# EAGLE schematic esp32 (EAGLE 8.2.2)
CNAME: Simulacare; CREVISION: 1.0.0; DESIGNER: Rinaldo; UNTITLED: Board ESP32
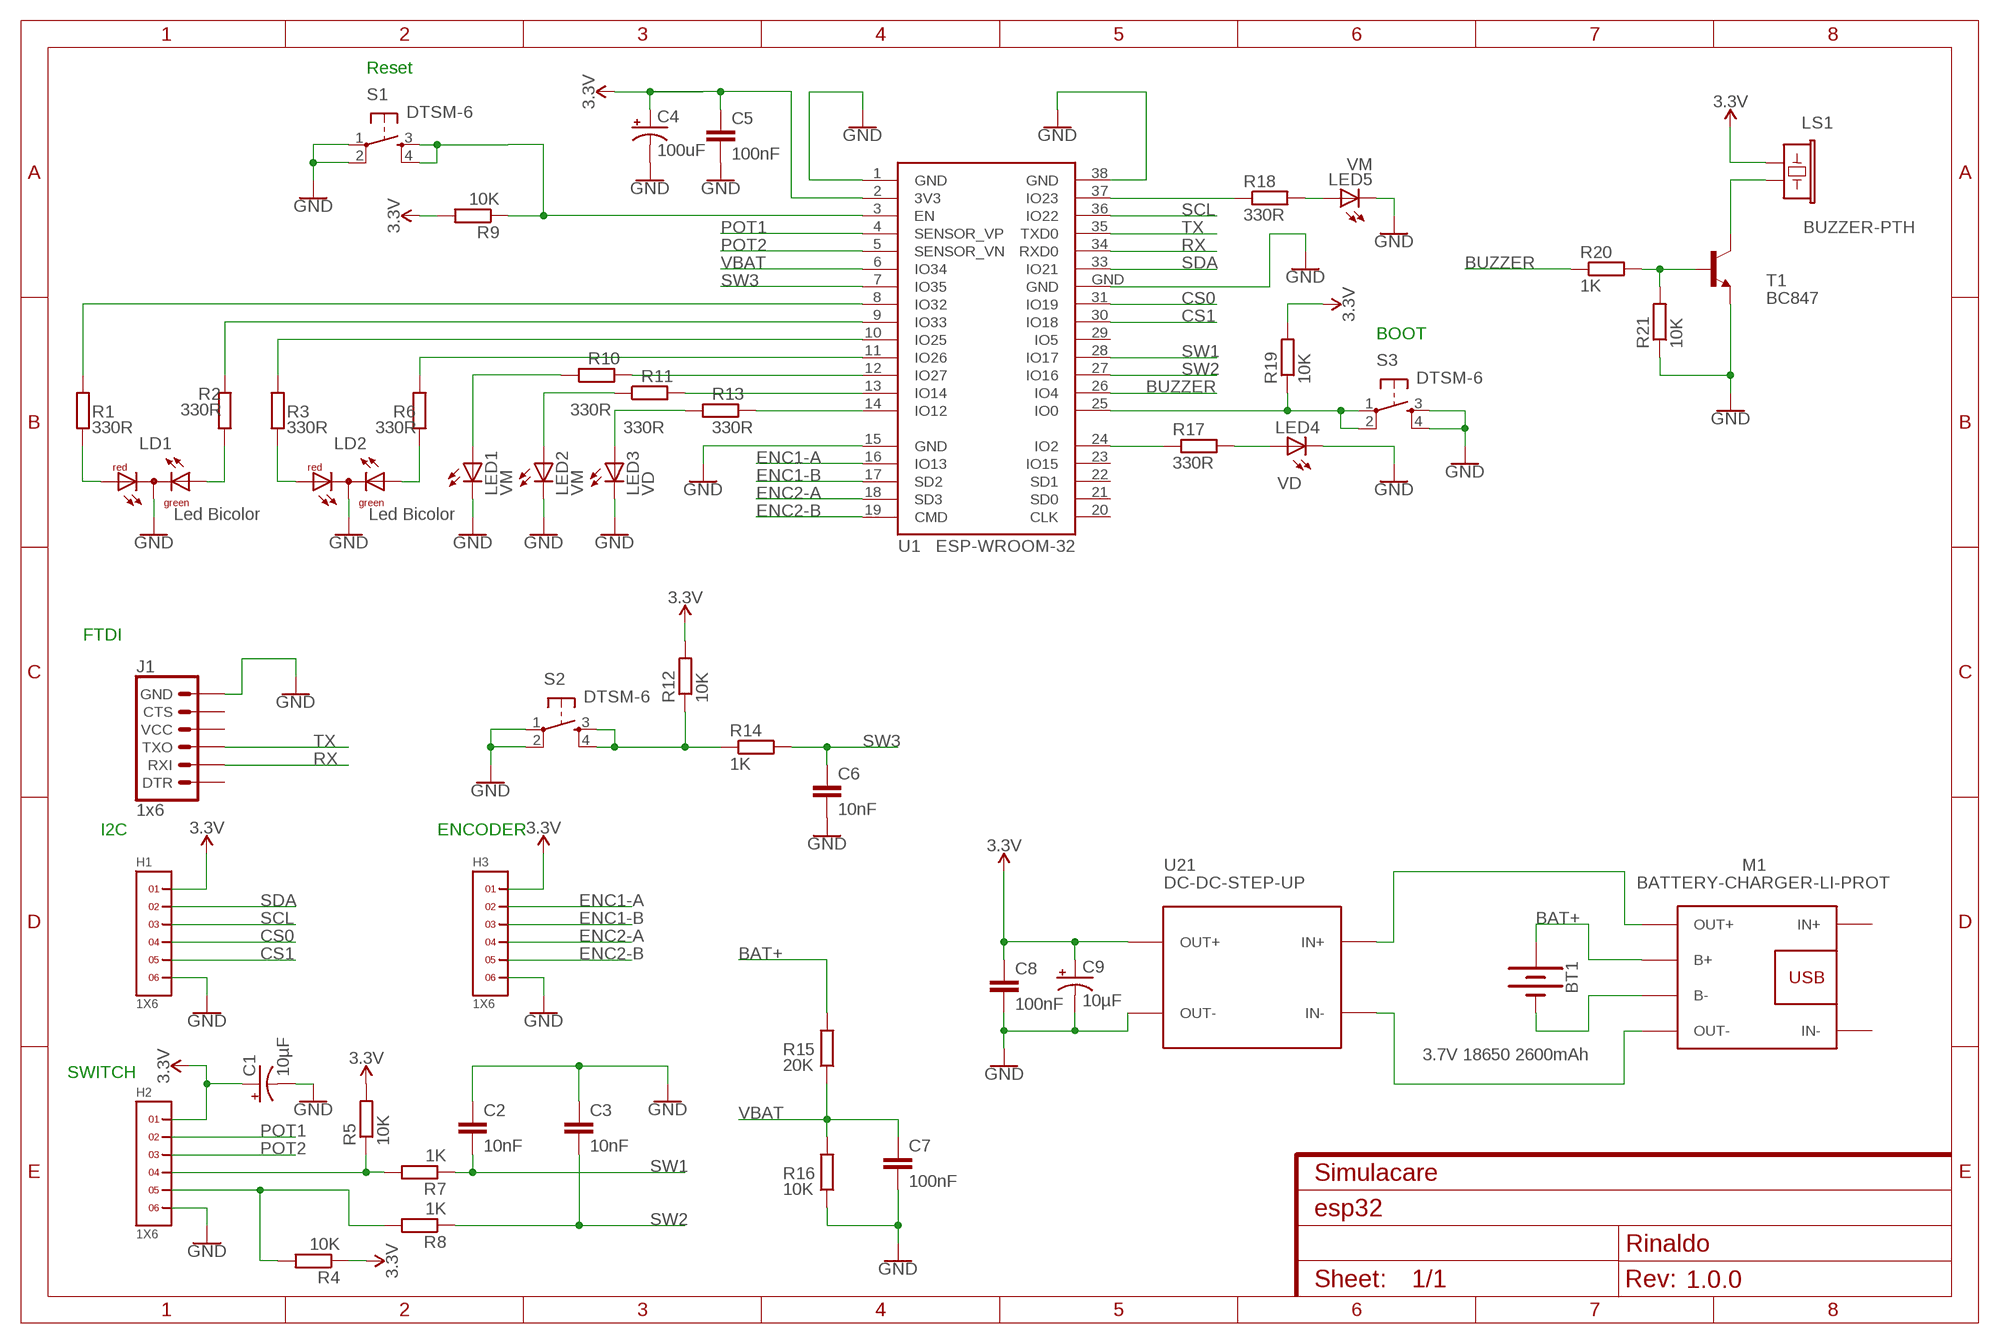
[diagram p0: schematic, sheet 1]

## Parts
BT1  3.7V 18650 2600mAh  BATTERY-18650  [BATTERY_18650-HOLDER]
C1  10µF  10UF-POLAR-EIA6032-25V-10%  [EIA6032-NOM]
C2  10nF  0.1UF-0603-25V-5%  [0603]
C3  10nF  0.1UF-0603-25V-5%  [0603]
C4  100uF  100UF-POLAR-10X10.5-63V-20%  [NIC_10X10.5_CAP]
C5  100nF  0.1UF-0603-25V-5%  [0603]
C6  10nF  0.1UF-0603-25V-5%  [0603]
C7  100nF  0.1UF-0603-25V-5%  [0603]
C8  100nF  0.1UF-0603-25V-5%  [0603]
C9  10µF  10UF-POLAR-EIA6032-25V-10%  [EIA6032-NOM]
H1  1X6  [1X6]
H2  1X6  [1X6]
H3  1X6  [1X6]
J1  1x6  6_PIN_SERIAL_TARGETSILK  [6_PIN_SERIAL_TARGET_SIDE_W_SILK]
LD1  Led Bicolor  DUOLED-RG-C  [DUOLED-C-5MM]
LD2  Led Bicolor  DUOLED-RG-C  [DUOLED-C-5MM]
LED1  VM  LED5MM  [LED5MM]
LED2  VM  LED5MM  [LED5MM]
LED3  VD  LED5MM  [LED5MM]
LED4  VD  LED5MM  [LED5MM]
LED5  VM  LED5MM  [LED5MM]
LS1  BUZZER-PTH  [BUZZER-12MM]
M1  BATTERY-CHARGER-LI-PROT  [BATTERY-CHARGER-LI-PROT]
R1  330R  R-EU_R0603  [R0603]
R2  330R  R-EU_R0603  [R0603]
R3  330R  R-EU_R0603  [R0603]
R4  10K  R-EU_R0603  [R0603]
R5  10K  R-EU_R0603  [R0603]
R6  330R  R-EU_R0603  [R0603]
R7  1K  R-EU_R0603  [R0603]
R8  1K  R-EU_R0603  [R0603]
R9  10K  R-EU_R0603  [R0603]
R10  330R  R-EU_R0603  [R0603]
R11  330R  R-EU_R0603  [R0603]
R12  10K  R-EU_R0603  [R0603]
R13  330R  R-EU_R0603  [R0603]
R14  1K  R-EU_R0603  [R0603]
R15  20K  R-EU_R0603  [R0603]
R16  10K  R-EU_R0603  [R0603]
R17  330R  R-EU_R0603  [R0603]
R18  330R  R-EU_R0603  [R0603]
R19  10K  R-EU_R0603  [R0603]
R20  1K  R-EU_R0603  [R0603]
R21  10K  R-EU_R0603  [R0603]
S1  DTSM-6  [DTSM-6]
S2  DTSM-6  [DTSM-6]
S3  DTSM-6  [DTSM-6]
T1  BC847  [SOT23]
U1  ESP-WROOM-32  [ESP-WROOM-32]
U21  DC-DC-STEP-UP  DC-DC-STEP-UP-MT3608  [DC-DC-STEP-UP-MT3608]

## Nets
3.3V: C1.A(+) C4.+ C5.1 C8.1 C9.A(+) H1.1 H2.1 H3.1 LS1.+ R4.1 R5.2 R9.2 R12.2 R19.2 U1.2(3V3) U21.OUT+
BAT+: BT1.PWR@1(+) M1.B+ R15.2
BUZZER: R20.1 U1.26(IO4)
CS0: H1.4 U1.31(IO19)
CS1: H1.5 U1.30(IO18)
ENC1-A: H3.2 U1.16(IO13)
ENC1-B: H3.3 U1.17(SD2)
ENC2-A: H3.4 U1.18(SD3)
ENC2-B: H3.5 U1.19(CMD)
GND: C1.C(-) C2.1 C3.1 C4.- C5.2 C6.2 C7.2 C8.2 C9.C(-) H1.6 H2.6 H3.6 J1.P$6(GND) LD1.C LD2.C LED1.K(C) LED2.K(C) LED3.K(C) LED4.K(C) LED5.K(C) R16.1 R21.1 S1.1 S1.2 S2.1 S2.2 S3.3 S3.4 T1.2(E) U1.1(GND) U1.15(GND) U1.38(GND) U1.GND U21.OUT-
N$1: R9.1 S1.3 S1.4 U1.3(EN)
N$2: R13.2 U1.14(IO12)
N$3: R11.2 U1.13(IO14)
N$4: R10.2 U1.12(IO27)
N$5: LED3.A R13.1
N$6: LED2.A R11.1
N$7: LED1.A R10.1
N$8: LD1.AR R1.1
N$9: LD1.AX(AG) R2.1
N$10: R1.2 U1.8(IO32)
N$11: R2.2 U1.9(IO33)
N$12: LD2.AR R3.1
N$13: LD2.AX(AG) R6.1
N$14: R3.2 U1.10(IO25)
N$15: R6.2 U1.11(IO26)
N$16: R18.1 U1.37(IO23)
N$17: LED5.A R18.2
N$18: R19.1 S3.1 S3.2 U1.25(IO0)
N$19: R17.1 U1.24(IO2)
N$20: BT1.GND@1(-) M1.B-
N$21: LS1.- T1.3(C)
N$22: R20.2 R21.2 T1.1(B)
N$23: LED4.A R17.2
N$24: R12.1 R14.1 S2.3 S2.4
N$25: H2.4 R5.1 R7.2
N$26: H2.5 R4.2 R8.2
N$29: M1.OUT- U21.IN-
N$30: M1.OUT+ U21.IN+
POT1: H2.2 U1.4(SENSOR_VP)
POT2: H2.3 U1.5(SENSOR_VN)
RX: J1.P$3(RXI) U1.34(RXD0)
SCL: H1.3 U1.36(IO22)
SDA: H1.2 U1.33(IO21)
SW1: C2.2 R7.1 U1.28(IO17)
SW2: C3.2 R8.1 U1.27(IO16)
SW3: C6.1 R14.2 U1.7(IO35)
TX: J1.P$2(TXO) U1.35(TXD0)
VBAT: C7.1 R15.1 R16.2 U1.6(IO34)
Unconnected: J1.P$1(DTR) J1.P$4(VCC) J1.P$5(CTS) M1.IN+ M1.IN- U1.20(CLK) U1.21(SD0) U1.22(SD1) U1.23(IO15) U1.29(IO5)

## Notes on the sheet
- Reset
- BOOT
- FTDI
- I2C | ENCODER
- SWITCH

## Library data of the parts
BT1 = SparkFun-Batteries:BATTERY: Battery - Single Cell A variety of battery chemistries, sizes, and footprints. Device List: 20MM_PTH - Coin Cell Battery Holder - 20mm (PTH) <https://www.sparkfun.com/products/783> 6.8MM_PTH - Coin Cell Battery Holder - 6.8MM(SMD) <https://www.digikey.com/product-detail/en/seiko-instruments/MS621FE-FL11E/728-1057-ND/1889208?WT.srch=1&gclid=CNOQ5a6LzdQCFZS2wAodXCkE0g> 12MM_SMD - Coin Cell Battery Holder - 12mm (SMD) <https://www.sparkfun.com/products/10592> 12MM_PTH - Coin Cell Battery Holder - 12mm (PTH) <https://www.sparkfun.com/products/7948> 20MM_SMD - 20mm Coin Cell Battery Holder (SMD) (2 legs) Used on the Big Time Watch Kit <https://www.sparkfun.com/products/11734> 20MM_SMD_4LEGS - Coin Cell Battery Holder - 20mm (SMD) <https://www.sparkfun.com/products/11892> 20MM_SMD_4LEGS_OVERPASTE - Coin Cell Battery Holder - 20mm (SMD) <https://www.sparkfun.com/products/11892> (Over-paste on the legs) 24.5MM_PTH - Coin Cell Battery Holder - 24.5mm (PTH) <https://www.sparkfun.com/products/8863> 9V - 9V Battery Holder - PC Mount Used on the SparkFun SparkPunk Sound Kit <https://www.sparkfun.com/products/11177> and SparkFun SparkPunk Sequencer Kit <https://www.sparkfun.com/products/12707> 18650 - Battery Holder - 18650 (PTH) <https://www.sparkfun.com/products/13113> AA - Battery Holder - 1xAA (PTH) <https://www.sparkfun.com/products/7949> AAA - Battery Holder - 1xAAA (PTH) <https://www.sparkfun.com/products/12718> AA_KIT - Battery Holder - 1xAA (PTH) <https://www.sparkfun.com/products/7949> Special kit package - pads only have exposed copper on one side of the board. AAA_KIT - Battery Holder - 1xAAA (PTH) <https://www.sparkfun.com/products/12718> Special kit package - pads only have exposed copper on one side of the board.; PROD_ID: BATT-12327; SF_SKU: PRT-13113
C1 C9 = SparkFun-Capacitors:10UF-POLAR: 10.0µF polarized capacitors A capacitor is a passive two-terminal electrical component used to store electrical energy temporarily in an electric field.; PROD_ID: CAP-12984
C2 C3 C5-C8 = SparkFun-Capacitors:0.1UF: 0.1µF ceramic capacitors A capacitor is a passive two-terminal electrical component used to store electrical energy temporarily in an electric field.; PROD_ID: CAP-08604; VALUE: 0.1uF
C4 = SparkFun-Capacitors:100UF-POLAR: 100µF polarized capacitors A capacitor is a passive two-terminal electrical component used to store electrical energy temporarily in an electric field.; PROD_ID: CAP-08362
H1-H3 = header:1X6
J1 = SparkFun-Connectors:6_PIN_SERIAL_TARGET: 6-pin header connection for use with the "FTDI BASIC" pinout - TARGET SIDE. Also known as "Arduino Serial Program Header". It is used to mate with our FTDI Basic serial programmers using the Arduino IDE. Note, this device has "TARGET" in the name. It is intended to be used on a design that contains a target micro-controller that you wish to program. The "sister" device, named "CABLE" is inteneded to be used on a design that usually lives on the end of your USB cable and prvides the converter chip (FTDI232 or FTDI231x) to commnicate serial RX/TX. You can populate with some of these: Break Away Headers - Straight <https://www.sparkfun.com/products/116> (PRT-00116) For reference (or to suit your programming needs) check out these designs: SparkFun FTDI Basic Breakout - 5V <https://www.sparkfun.com/products/9716> (DEV-09716) SparkFun FTDI Basic Breakout - 3.3V <https://www.sparkfun.com/products/9873> (DEV-09873) SparkFun FTDI SmartBasic <https://www.sparkfun.com/products/12935> (DEV-12935) SparkFun Beefy 3 - FTDI Basic Breakout <https://www.sparkfun.com/products/13746> (DEV-13746)
LD1 LD2 = led:DUOLED-RG-C: DUO LED 2 colors (red/green), 5 mm, round, common Cathode www.ligitek.com or other producers.
LED1-LED5 = adafruit:LED: LED OSRAM: - CHIPLED LG R971, LG N971, LY N971, LG Q971, LY Q971, LO R971, LY R971 LH N974, LH R974 LS Q976, LO Q976, LY Q976 LO Q996 - Hyper CHIPLED LW Q18S LB Q993, LB Q99A, LB R99A - SideLED LS A670, LO A670, LY A670, LG A670, LP A670 LB A673, LV A673, LT A673, LW A673 LH A674 LY A675 LS A676, LA A676, LO A676, LY A676, LW A676 LS A679, LY A679, LG A679 - Hyper Micro SIDELED® LS Y876, LA Y876, LO Y876, LY Y876 LT Y87S - SmartLED LW L88C, LW L88S LB L89C, LB L89S, LG L890 LS L89K, LO L89K, LY L89K LS L896, LA L896, LO L896, LY L896 - TOPLED LS T670, LO T670, LY T670, LG T670, LP T670 LSG T670, LSP T670, LSY T670, LOP T670, LYG T670 LG T671, LOG T671, LSG T671 LB T673, LV T673, LT T673, LW T673 LH T674 LS T676, LA T676, LO T676, LY T676, LB T676, LH T676, LSB T676, LW T676 LB T67C, LV T67C, LT T67C, LS T67K, LO T67K, LY T67K, LW E67C LS E67B, LA E67B, LO E67B, LY E67B, LB E67C, LV E67C, LT E67C LW T67C LS T679, LY T679, LG T679 LS T770, LO T770, LY T770, LG T770, LP T770 LB T773, LV T773, LT T773, LW T773 LH T774 LS E675, LA E675, LY E675, LS T675 LS T776, LA T776, LO T776, LY T776, LB T776 LHGB T686 LT T68C, LB T68C - Hyper Mini TOPLED® LB M676 - Mini TOPLED Santana® LG M470 LS M47K, LO M47K, LY M47K Source: http://www.osram.convergy.de/
LS1 = SparkFun-Electromechanical:BUZZER: Buzzer Small round buzzers that operate around the audible 2kHz range. You can use these as speakers to create simple music or user interfaces. Variant Overview: PTH - Mini Speaker - PC Mount 12mm 2.048kHz <https://www.sparkfun.com/products/7950> PTH_KIT - Mini Speaker - PC Mount 12mm 2.048kHz <https://www.sparkfun.com/products/7950> KIT simplifies soldering by adding stop mask to one side of the pads. PTH_NO_SILK - Mini Speaker - PC Mount 12mm 2.048kHz <https://www.sparkfun.com/products/7950> No silkscreen indicator of buzzer outline. PTH_KIT_NO_SILK - Mini Speaker - PC Mount 12mm 2.048kHz <https://www.sparkfun.com/products/7950> KIT package w/o silkscreen SMD - Buzzer Audio Magnetic (CCV-084B16) SMD buzzer used on, e.g. the LilyPad Buzzer <https://www.sparkfun.com/products/8463> and RFID USB Reader <https://www.sparkfun.com/products/9963>. SMD_KIT - Buzzer Audio Magnetic (CCV-084B16) SMD Buzzer with elongated pins to make soldering easier. Used on the SparkFun Simon Says - Surface Mount Soldering Kit <https://www.sparkfun.com/products/10935>.; PROD_ID: COMP-08253; SF_SKU: COM-07950
M1 = diy-modules:BATTERY-CHARGER-LI-PROT: Lithium Battery 5V Charger with protection circuit More details available here: http://www.instructables.com/id/DIY-Lithium-ion-Battery-Charger/step4/TP4056-based-lithium-ion-battery-charger-module/ Click here to find device on ebay.com <http://www.ebay.com/sch/tp4056+charger+usb+protection>
R1-R21 = resistor:R-EU_: RESISTOR, European symbol
S1-S3 = switch-tact:DTSM-6
T1 = transistor:BC847: NPN TRANSISTOR
U1 = esp32:ESP-WROOM-32: Espressif Systems ESP-WROOM-32
U21 = diy-modules:DC-DC-STEP-UP-MT3608: DC/DC Step-Up Regulator based on MT3608 chip MT3608 datasheet available here: https://www.olimex.com/Products/Breadboarding/BB-PWR-3608/resources/MT3608.pdf Click here to find device on ebay.com <http://www.ebay.com/sch/mt3608+module>